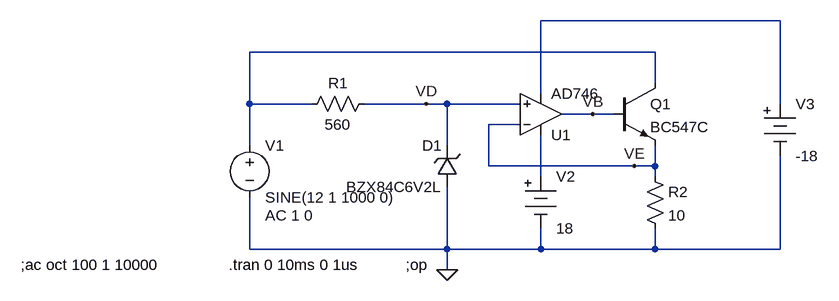
[diagram p0: schematic zenerstab.asc]
zenerstab.asc, the LTspice schematic file:
Version 4
SHEET 1 1228 680
WIRE 800 -64 432 -64
WIRE 608 -16 -16 -16
WIRE 608 32 608 -16
WIRE 432 48 432 -64
WIRE -16 64 -16 -16
WIRE 80 64 -16 64
WIRE 256 64 160 64
WIRE 288 64 256 64
WIRE 400 64 288 64
WIRE 800 64 800 -64
WIRE 512 80 464 80
WIRE 544 80 512 80
WIRE 400 96 352 96
WIRE -16 128 -16 64
WIRE 288 128 288 64
WIRE 352 160 352 96
WIRE 576 160 352 160
WIRE 608 160 608 128
WIRE 608 160 576 160
WIRE 432 176 432 112
WIRE 608 176 608 160
WIRE -16 288 -16 208
WIRE 288 288 288 192
WIRE 288 288 -16 288
WIRE 432 288 432 256
WIRE 432 288 288 288
WIRE 608 288 608 256
WIRE 608 288 432 288
WIRE 800 288 800 144
WIRE 800 288 608 288
WIRE 288 320 288 288
FLAG 256 64 VD
FLAG 288 320 0
FLAG 576 160 VE
FLAG 512 80 VB
DATAFLAG 496 -16 ""
DATAFLAG -16 64 ""
SYMBOL voltage -16 112 R0
WINDOW 123 24 124 Left 2
WINDOW 39 0 0 Left 0
SYMATTR Value2 AC 1 0
SYMATTR InstName V1
SYMATTR Value SINE(12 1 1000 0)
SYMBOL res 176 48 R90
WINDOW 0 0 56 VBottom 2
WINDOW 3 32 56 VTop 2
SYMATTR InstName R1
SYMATTR Value 560
SYMBOL zener 304 192 R180
WINDOW 0 24 64 Left 2
WINDOW 3 24 0 Left 2
SYMATTR InstName D1
SYMATTR Value BZX84C6V2L
SYMBOL npn 544 32 R0
SYMATTR InstName Q1
SYMATTR Value BC547C
SYMBOL res 592 160 R0
SYMATTR InstName R2
SYMATTR Value 10
SYMBOL Opamps\\AD746 432 144 M180
SYMATTR InstName U1
SYMBOL Misc\\battery 432 160 R0
WINDOW 123 0 0 Left 0
WINDOW 39 0 0 Left 0
SYMATTR InstName V2
SYMATTR Value 18
SYMBOL Misc\\battery 800 48 R0
WINDOW 123 0 0 Left 0
WINDOW 39 0 0 Left 0
SYMATTR InstName V3
SYMATTR Value -18
TEXT -48 312 Left 2 !.tran 0 10ms 0 1us
TEXT 224 312 Left 2 !;op
TEXT -368 312 Left 2 !;ac oct 100 1 10000

The netlist it stands for:
* zenerstab.asc
V1 N002 0 SINE(12 1 1000 0) AC 1 0
R1 VD N002 560
D1 0 VD BZX84C6V2L
Q1 N002 VB VE 0 BC547C
R2 VE 0 10
XU1 VD VE N003 N001 VB AD746  ; pins In+ In- V+ V- OUT
V2 N003 0 18
V3 N001 0 -18
.model D D
.lib standard.dio
.model NPN NPN
.model PNP PNP
.lib standard.bjt
.tran 0 10ms 0 1us
;op
;ac oct 100 1 10000
.backanno
.end